# Altium schematic sheet SensorSuite.SchDoc
size A4; SheetNumber: 3; SheetTotal: 5
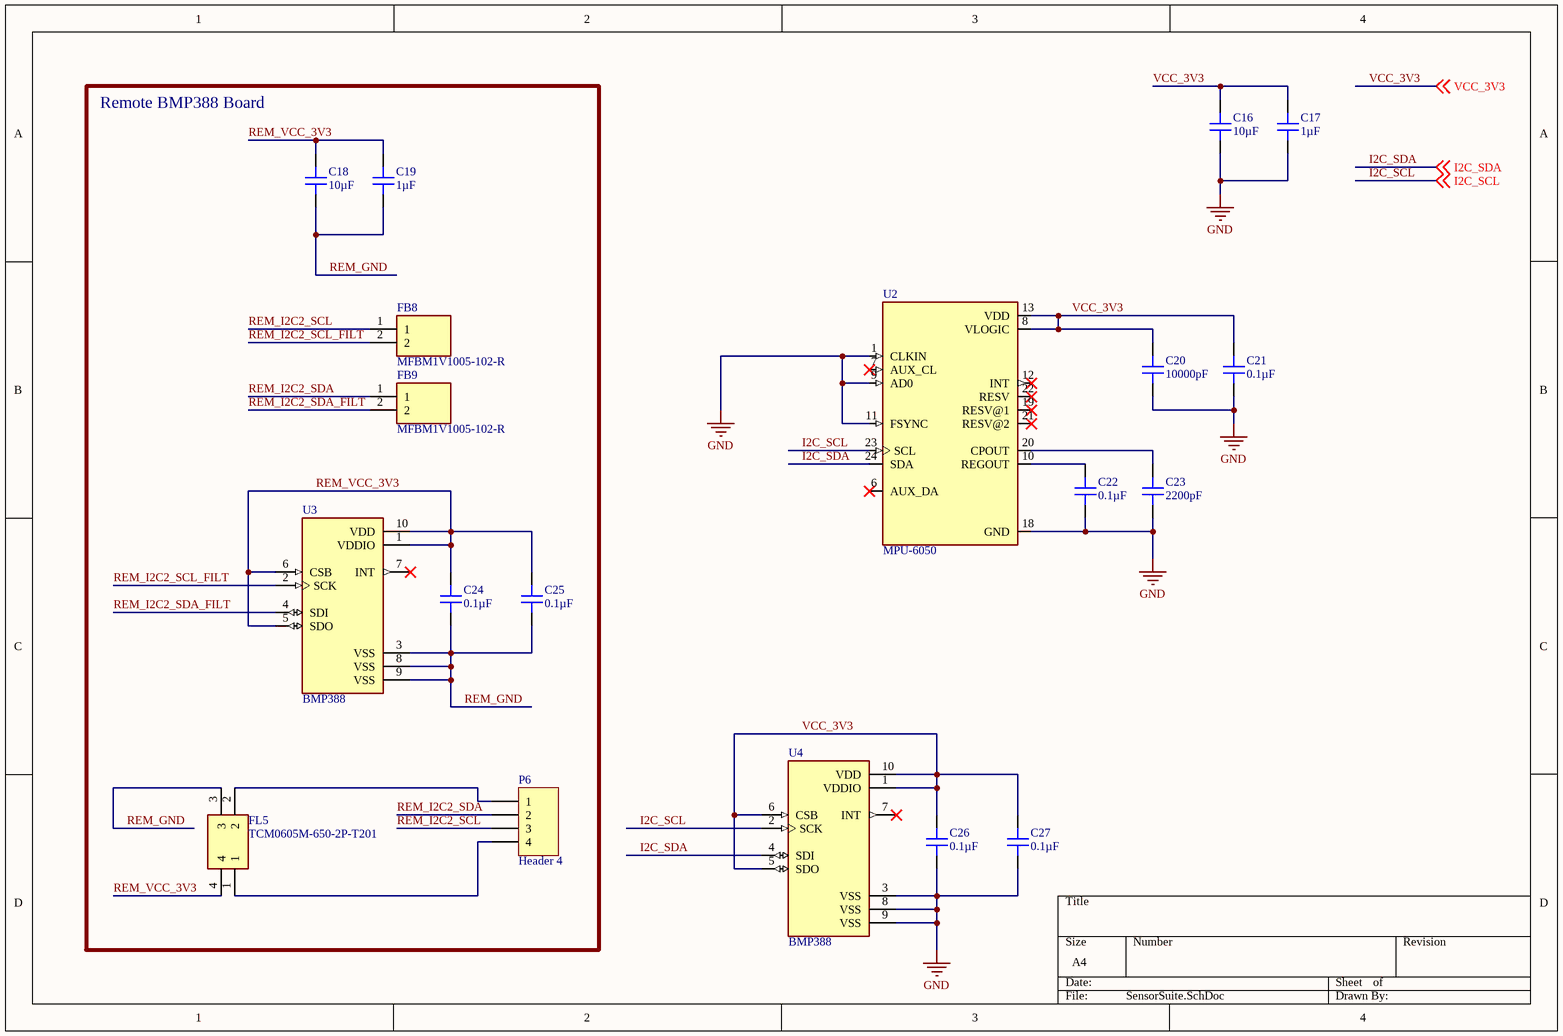
[diagram p0: SensorSuite.SchDoc]

## Parts
C16  10µF  [CAP 0402_1005]
C17  1µF  [CAP 0402_1005]
C18  10µF  [CAP 0402_1005]
C19  1µF  [CAP 0402_1005]
C20  10000pF  [CAP 0402_1005]
C21  0.1µF  [CAP 0402_1005]
C22  0.1µF  [CAP 0402_1005]
C23  2200pF  [CAP 0402_1005]
C24  0.1µF  [CAP 0402_1005]
C25  0.1µF  [CAP 0402_1005]
C26  0.1µF  [CAP 0402_1005]
C27  0.1µF  [CAP 0402_1005]
FB8  MFBM1V1005-102-R  [BEADC1005X65N]
FB9  MFBM1V1005-102-R  [BEADC1005X65N]
FL5  TCM0605M-650-2P-T201  [TCM0605M]
P6  Header 4  [HDR1X4]
U2  MPU-6050  [QFN50P400X400X95-24N]
U3  BMP388  [PQFN50P200X200X80-10N]
U4  BMP388  [PQFN50P200X200X80-10N]

## Blocks framed on the sheet
Remote BMP388 Board: C18 C19 C24 C25 FB8 FB9 FL5 P6 U3

## Nets
GND: C16.1 C17.1 C20.1 C21.1 C22.1 C23.1 C26.1 C27.1 U2.1(CLKIN) U2.9(AD0) U2.11(FSYNC) U2.18(GND) U4.3(VSS) U4.8(VSS) U4.9(VSS)
I2C_SCL: U2.23(SCL) U4.2(SCK) ; off-sheet I2C_SCL
I2C_SDA: U2.24(SDA) U4.4(SDI) ; off-sheet I2C_SDA
REM_GND: C18.1 C19.1 C24.1 C25.1 FL5.3 U3.3(VSS) U3.8(VSS) U3.9(VSS)
REM_I2C2_SCL: FB8.1 P6.3
REM_I2C2_SCL_FILT: FB8.2 U3.2(SCK)
REM_I2C2_SDA: FB9.1 P6.2
REM_I2C2_SDA_FILT: FB9.2 U3.4(SDI)
REM_VCC_3V3: C18.2 C19.2 C24.2 C25.2 FL5.4 U3.1(VDDIO) U3.5(SDO) U3.6(CSB) U3.10(VDD)
VCC_3V3: C16.2 C17.2 C20.2 C21.2 C26.2 C27.2 U2.8(VLOGIC) U2.13(VDD) U4.1(VDDIO) U4.5(SDO) U4.6(CSB) U4.10(VDD) ; off-sheet VCC_3V3
NetC22_2: C22.2 U2.10(REGOUT)
NetC23_2: C23.2 U2.20(CPOUT)
NetFL5_1: FL5.1 P6.4
NetFL5_2: FL5.2 P6.1

Not connected (* = marked no-connect by the designer): U2 6(AUX_DA)* 7(AUX_CL)* 12(INT)* 19(RESV@1)* 21(RESV@2)* 22(RESV)*; U3 7(INT)*; U4 7(INT)*

## Library data of the parts
C16 C18 = C0402C106M9PAC7867: CAP CER 10UF 6.3V X5R 0402; Manufacturer: KEMET; Tolerance: ±20%; Part Number: C0402C106M9PAC7867; Value: 10µF; Applications: General Purpose; Capacitance: 10µF; ComponentLink1Description: Datasheet; ComponentLink1URL: https://api.kemet.com/component-edge/download/datasheet/C0402C106M9PAC7867.pdf; ComponentLink2Description: DigiKey Link; ComponentLink2URL: http://digikey.com/product-detail/en/kemet/C0402C106M9PAC7867/399-13069-1-ND/5767556; Device Package: 0402 (1005 Metric); LastUpdated: 2/9/2020 1:02:21 AM; Lifecycle Status: Active; Minimum Order: 1; Mounting Type: Surface Mount, MLCC; Operating Temperature: -55°C ~ 85°C; Package / Case: 0402 (1005 Metric); Packaging: TapeAndReel; PartId: 3087; Part Status: Active; Price: 0.13; Series: SMD Comm X5R; Size / Dimension: 0.039" L x 0.020" W (1.00mm x 0.50mm); Supplier 1: DigiKey; Supplier Part Number 1: 399-13069-1-ND; Temperature Coefficient: X5R; Thickness (Max): 0.028" (0.70mm); Voltage - Rated: 6.3V
C17 C19 = 0402YD105KAT2A: CAP CER 1UF 16V X5R 0402; Manufacturer: AVX Corporation; Tolerance: ±10%; Part Number: 0402YD105KAT2A; Value: 1µF; Applications: General Purpose; Capacitance: 1µF; ComponentLink1Description: Datasheet; ComponentLink1URL: http://datasheets.avx.com/cx5r.pdf; ComponentLink2Description: DigiKey Link; ComponentLink2URL: http://digikey.com/product-detail/en/avx-corporation/0402YD105KAT2A/478-10179-1-ND/6797606; Device Package: 0402 (1005 Metric); LastUpdated: 2/9/2020 1:02:22 AM; Lifecycle Status: Active; Minimum Order: 1; Mounting Type: Surface Mount, MLCC; Operating Temperature: -55°C ~ 85°C; Package / Case: 0402 (1005 Metric); Packaging: TapeAndReel; PartId: 2859; Part Status: Active; Price: 0.07; Series: -; Size / Dimension: 0.039" L x 0.020" W (1.00mm x 0.50mm); Supplier 1: DigiKey; Supplier Part Number 1: 478-10179-1-ND; Temperature Coefficient: X5R; Thickness (Max): 0.022" (0.55mm); Voltage - Rated: 16V
C20 = 0402B103K500CT: CAP CER 10000PF 50V X7R 0402; Manufacturer: Walsin Technology Corporation; Tolerance: ±10%; Part Number: 0402B103K500CT; Value: 10000pF; Applications: General Purpose; Capacitance: 10000pF; ComponentLink1Description: Datasheet; ComponentLink1URL: http://www.passivecomponent.com/wp-content/uploads/2018/10/MLCC.pdf; ComponentLink2Description: DigiKey Link; ComponentLink2URL: http://digikey.com/product-detail/en/walsin-technology-corporation/0402B103K500CT/1292-1628-1-ND/9355632; Device Package: 0402 (1005 Metric); LastUpdated: 2/9/2020 1:02:02 AM; Lifecycle Status: Active; Minimum Order: 1; Mounting Type: Surface Mount, MLCC; Operating Temperature: -55°C ~ 125°C; Package / Case: 0402 (1005 Metric); Packaging: CutTape; PartId: 11631; Part Status: Active; Price: 0.10; Series: -; Size / Dimension: 0.039" L x 0.020" W (1.00mm x 0.50mm); Supplier 1: DigiKey; Supplier Part Number 1: 1292-1628-1-ND; Temperature Coefficient: X7R; Thickness (Max): 0.022" (0.55mm); Voltage - Rated: 50V
C21 C22 C24-C27 = C0402C104K9PACTU: CAP CER 0.1UF 6.3V X5R 0402; Manufacturer: KEMET; Tolerance: ±10%; Part Number: C0402C104K9PACTU; Value: 0.1µF; Applications: General Purpose; Capacitance: 0.1µF; ComponentLink1Description: Datasheet; ComponentLink1URL: https://api.kemet.com/component-edge/download/datasheet/C0402C104K9PACTU.pdf; ComponentLink2Description: DigiKey Link; ComponentLink2URL: http://digikey.com/product-detail/en/kemet/C0402C104K9PACTU/399-3026-1-ND/447602; Device Package: 0402 (1005 Metric); LastUpdated: 2/9/2020 1:01:34 AM; Lifecycle Status: Active; Minimum Order: 1; Mounting Type: Surface Mount, MLCC; Operating Temperature: -55°C ~ 85°C; Package / Case: 0402 (1005 Metric); Packaging: TapeAndReel; PartId: 12742; Part Status: Active; Price: 0.01; Series: SMD Comm X5R; Size / Dimension: 0.039" L x 0.020" W (1.00mm x 0.50mm); Supplier 1: DigiKey; Supplier Part Number 1: 399-3026-1-ND; Temperature Coefficient: X5R; Thickness (Max): 0.022" (0.55mm); Voltage - Rated: 6.3V
C23 = 0402B222K500CT: CAP CER 2200PF 50V X7R 0402; Manufacturer: Walsin Technology Corporation; Tolerance: ±10%; Part Number: 0402B222K500CT; Value: 2200pF; Applications: General Purpose; Capacitance: 2200pF; ComponentLink1Description: Datasheet; ComponentLink1URL: http://www.passivecomponent.com/wp-content/uploads/2018/10/MLCC.pdf; ComponentLink2Description: DigiKey Link; ComponentLink2URL: http://digikey.com/product-detail/en/walsin-technology-corporation/0402B222K500CT/1292-1193-1-ND/9355197; Device Package: 0402 (1005 Metric); LastUpdated: 2/9/2020 1:02:01 AM; Lifecycle Status: Active; Minimum Order: 1; Mounting Type: Surface Mount, MLCC; Operating Temperature: -55°C ~ 125°C; Package / Case: 0402 (1005 Metric); Packaging: TapeAndReel; PartId: 11799; Part Status: Active; Price: 0.01; Series: -; Size / Dimension: 0.039" L x 0.020" W (1.00mm x 0.50mm); Supplier 1: DigiKey; Supplier Part Number 1: 1292-1193-1-ND; Temperature Coefficient: X7R; Thickness (Max): 0.022" (0.55mm); Voltage - Rated: 50V
FB8 FB9 = MFBM1V1005-102-R: Ferrite Bead; Manufacturer_Name: Eaton; Manufacturer_Part_Number: MFBM1V1005-101-R; Assembly Instruction: DNP; Datasheet Link: https://www.mouser.in/datasheet/2/87/eaton_mfbm1v1005_high_current_multilayer_ferrite_c-1890673.pdf; Height: 0.65mm
FL5 = TCM0605M-650-2P-T201: Filter; Manufacturer_Name: TDK; Assembly Instruction: DNP; Datasheet Link: https://product.tdk.com/system/files/dam/doc/product/emc/emc/cmf_cmc/catalog/cmf_commercial_signal_tcm0605m_en.pdf; Height: 0.35mm; Manufacturer_Part_Number: TCM0605M-650-2P-T201
P6 = Header 4: Header, 4-Pin; LatestRevisionDate: 17-Jul-2002; LatestRevisionNote: Re-released for DXP Platform.; Publisher: Altium Limited
U2 = MPU-6050: Accelerometer, Gyroscope, 6 Axis Sensor IÂ²C Output; MF: TDK InvenSense; Price: None; Package: VFQFN-24 TDK InvenSense; MP: MPU-6050; Value: *; Availability: Unavailable; SnapEDA_Link: https://www.snapeda.com/parts/MPU-6050/TDK%20InvenSense/view-part/4503180/?ref=snap
U3 U4 = BMP388: Pressure Sensor 4.35PSI ~ 18.13PSI _30kPa ~ 125kPa_ Absolute 10-WFLGA; MF: Bosch Sensortec; MP: BMP388; Value: *; SnapEDA_Link: https://www.snapeda.com/parts/BMP388/Bosch%20Sensortec/view-part/2747857/?ref=snap; Package: WFLGA-10 Bosch Tools; Digi-Key_Part_Number: 828-1079-1-ND; Digi-Key_Purchase_URL: https://www.digikey.com/product-detail/en/bosch-sensortec/BMP388/828-1079-1-ND/8322640?utm_source=snapeda&utm_medium=aggregator&utm_campaign=symbol